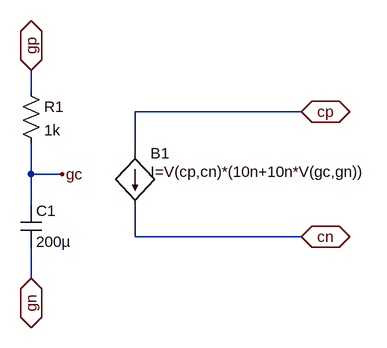
[diagram p0: schematic Capteur_Emul.asc]
Capteur_Emul.asc, the LTspice schematic file:
Version 4
SHEET 1 880 680
WIRE -96 -32 -96 -64
WIRE 320 0 64 0
WIRE 64 64 64 0
WIRE -96 96 -96 48
WIRE -48 96 -96 96
WIRE -96 144 -96 96
WIRE 64 192 64 144
WIRE 320 192 64 192
WIRE -96 256 -96 208
FLAG 320 0 cp
IOPIN 320 0 BiDir
FLAG 320 192 cn
IOPIN 320 192 BiDir
FLAG -96 -64 gp
IOPIN -96 -64 BiDir
FLAG -96 256 gn
IOPIN -96 256 BiDir
FLAG -48 96 gc
SYMBOL bi 64 64 R0
WINDOW 3 24 28 Left 2
SYMATTR Value I=V(cp,cn)*(10n+10n*V(gc,gn))
SYMATTR InstName B1
SYMBOL res -112 -48 R0
SYMATTR InstName R1
SYMATTR Value 1k
SYMBOL cap -112 144 R0
SYMATTR InstName C1
SYMATTR Value 200µ

The netlist it stands for:
* Capteur_Emul.asc
B1 cp cn I=V(cp,cn)*(10n+10n*V(gc,gn))
R1 gp gc 1k
C1 gc gn 200µ
.backanno
.end